# EAGLE schematic Schematic 1 v73 (EAGLE 9.7.0)
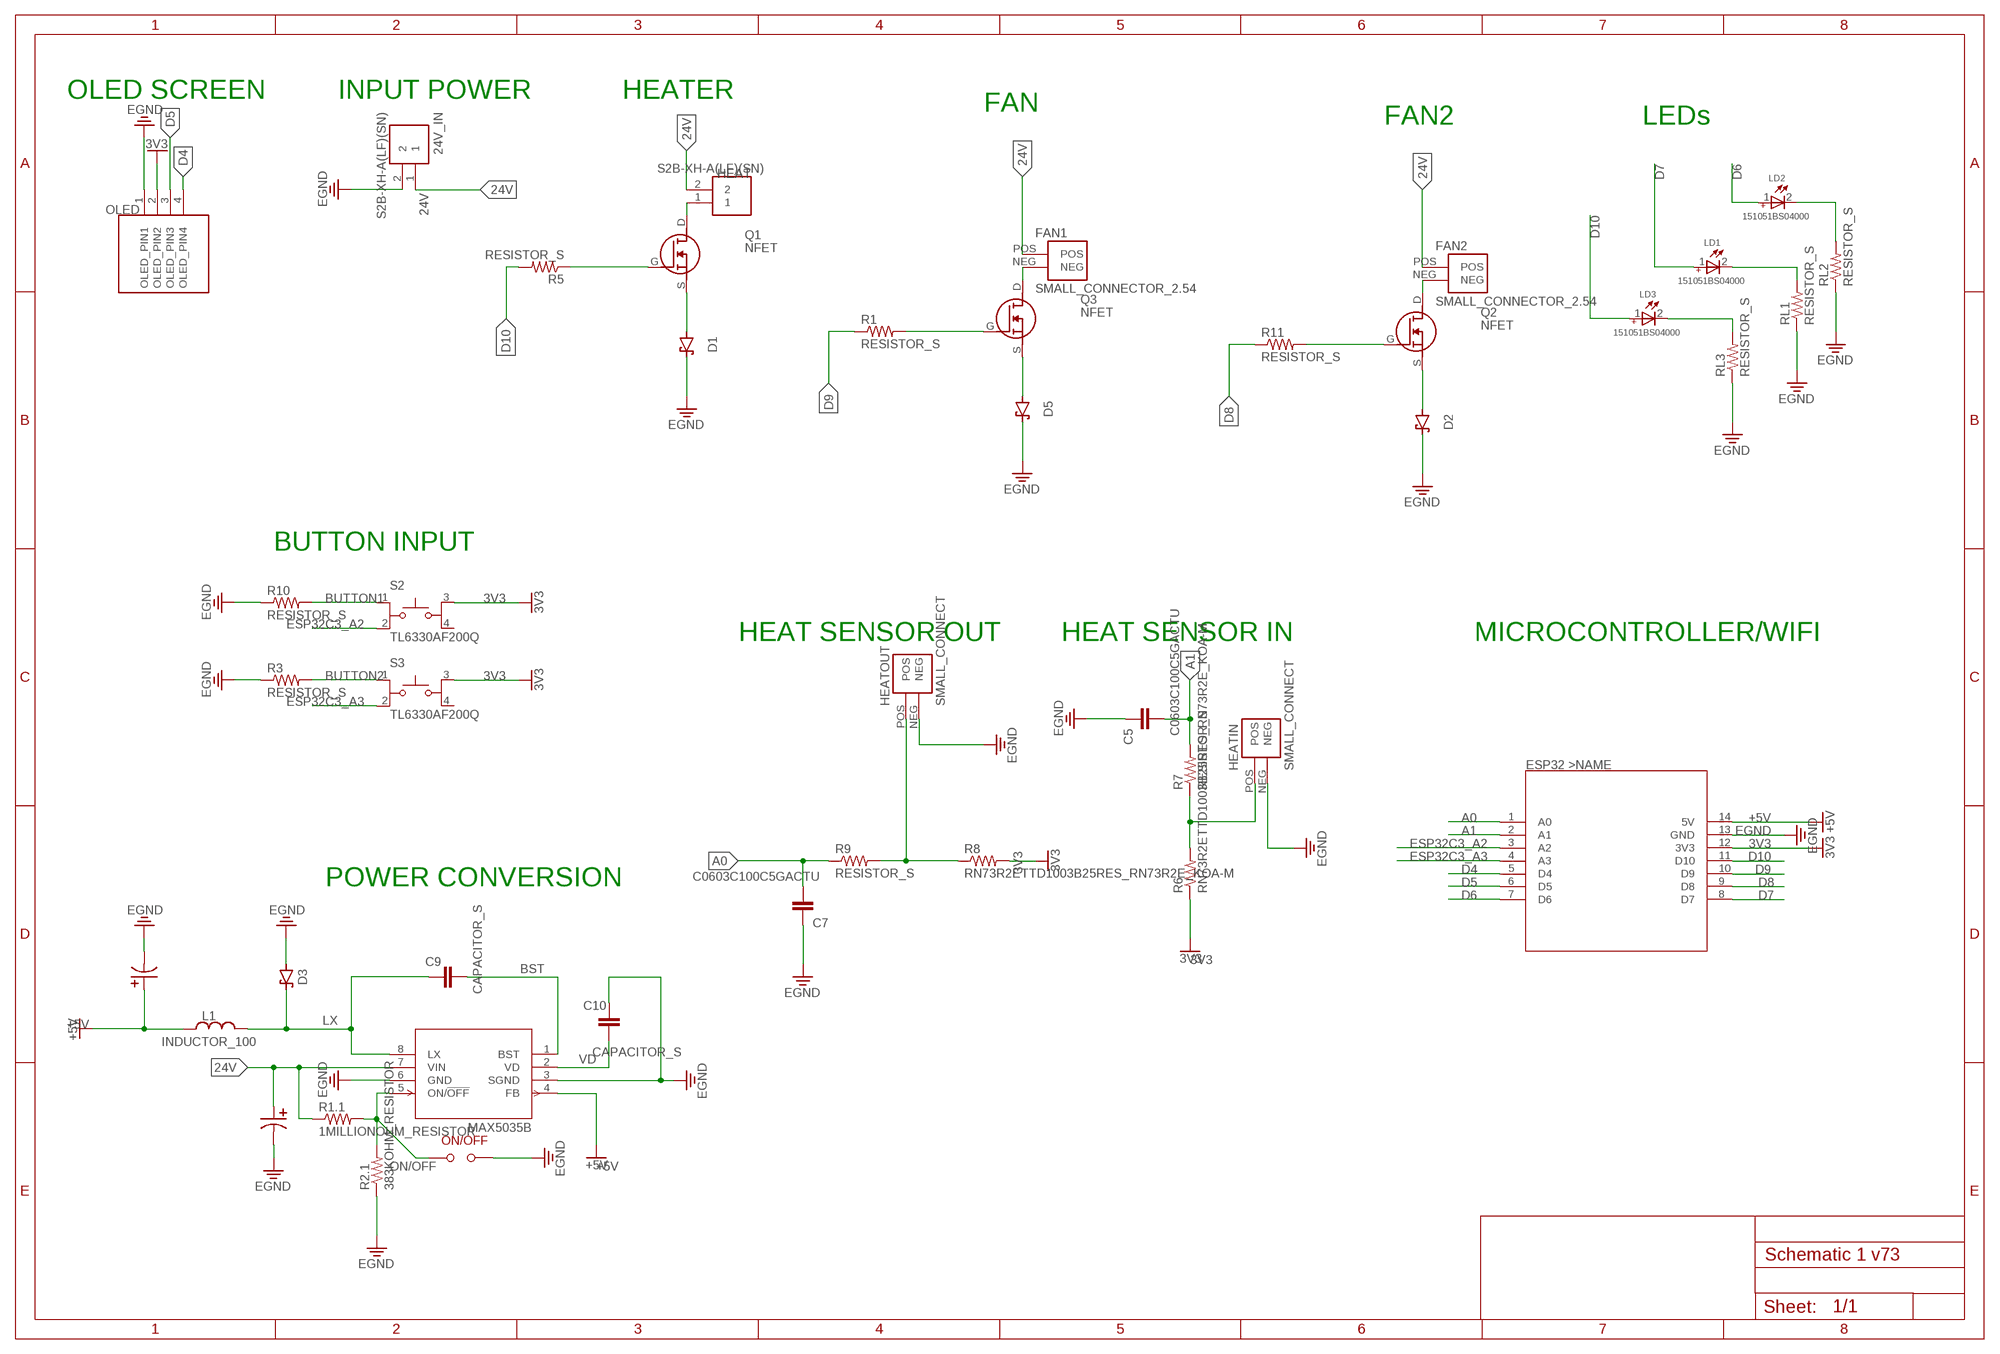
[diagram p0: schematic, sheet 1]

## Parts
24V_IN  S2B-XH-A(LF)(SN)  [HDR-02/RA]
C5  C0603C100C5GACTU  [CAP_0603]
C7  C0603C100C5GACTU  [CAP_0603]
C9  CAPACITOR_S  CAPACITOR_M  [CAPACITOR_M]
C10  CAPACITOR_S  CAPACITOR_M  [CAPACITOR_M]
D1  ES1D  SCHOTTKY_S  [SCHOTTKY_DIODE_S]
D2  ES1D  SCHOTTKY_S  [SCHOTTKY_DIODE_S]
D3  MBR0520LT1G  PANJIT_SB52AFC~SB56AFC_SERIES_DIODE_SCHOTTKY  [PANJIT_SB52AFC~SB56AFC_SERIES_DIODE]
D5  ES1D  SCHOTTKY_S  [SCHOTTKY_DIODE_S]
ESP32C3  XIAO_ESP32C3_ALT  [XIIO_ESP32C3_ALT]
FAN1  SMALL_CONNECTOR_2.54  [SMALL_CONNECT2.54]
FAN2  SMALL_CONNECTOR_2.54  [SMALL_CONNECT2.54]
HEAT  S2B-XH-A(LF)(SN)  [HDR-02/RA]
HEATIN  SMALL_CONNECT  [SMALL_CONNECT]
HEATOUT  SMALL_CONNECT  [SMALL_CONNECT]
L1  INDUCTOR_100  100UH_INDUCTOR  [100UH_INDUCTOR]
LD1  151051BS04000  WL-TMRC_5MM_151051BS04000_WITHOUTSTOPPER  [WL-TMRC_5MM]
LD2  151051BS04000  WL-TMRC_5MM_151051BS04000_WITHOUTSTOPPER  [WL-TMRC_5MM]
LD3  151051BS04000  WL-TMRC_5MM_151051BS04000_WITHOUTSTOPPER  [WL-TMRC_5MM]
OLED  I2C_OLED  [I2C_OLED]
ON/OFF  SOLDER_JUMPER  [SOLDER_JUMPER]
PC1  POLORIZED_100UF  TANTALUM_CAP  [TANTALUM_CAPACITOR_68UF]
PC2  68UF_POLORIZED_CAP  [68UF_CAPAE830X1000N]
Q1  NFET  [NFET]
Q2  NFET  [NFET]
Q3  NFET  [NFET]
R1  RESISTOR_S  [RESISTOR_S]
R1.1  1MILLIONOHM_RESISTOR  [1MOHM_RESISTOR_SMD]
R2.1  383KOHM_RESISTOR  [383KOHM_RESISTOR_0805]
R3  RESISTOR_S  [RESISTOR_S]
R5  RESISTOR_S  [RESISTOR_S]
R6  RN73R2ETTD1003B25RES_RN73R2E_KOA-M  [RES_RN73R2E_KOA-M]
R7  RESISTOR_S  [RESISTOR_S]
R8  RN73R2ETTD1003B25RES_RN73R2E_KOA-M  [RES_RN73R2E_KOA-M]
R9  RESISTOR_S  [RESISTOR_S]
R10  RESISTOR_S  [RESISTOR_S]
R11  RESISTOR_S  [RESISTOR_S]
RL1  RESISTOR_S  [RESISTOR_S]
RL2  RESISTOR_S  [RESISTOR_S]
RL3  RESISTOR_S  [RESISTOR_S]
S2  TL6330AF200Q  [SW_TL6330AF200Q]
S3  TL6330AF200Q  [SW_TL6330AF200Q]
U1  MAX5035BASA+T  [21-0041B_8_MXM-M]

## Nets
3V3: ESP32C3.12(3V3) OLED.2(OLED_PIN2) R6.2 R8.1 S2.3 S3.3
24V: 24V_IN.1 FAN1.POS FAN2.POS HEAT.2 PC2.POS R1.1.2 U1.7(VIN)
+5V: ESP32C3.14(5V) L1.P$1 PC1.+(POS) U1.4(FB)
A0: C7.2 ESP32C3.1(A0) R9.2
A1: C5.2 ESP32C3.2(A1) R7.1
BST: C9.2 U1.1(BST)
BUTTON1: R10.1 S2.1
BUTTON2: R3.1 S3.1
D4: ESP32C3.5(D4) OLED.4(OLED_PIN4)
D5: ESP32C3.6(D5) OLED.3(OLED_PIN3)
D6: ESP32C3.7(D6) LD2.1(+)
D7: ESP32C3.8(D7) LD1.1(+)
D8: ESP32C3.9(D8) R11.2
D9: ESP32C3.10(D9) R1.2
D10: ESP32C3.11(D10) LD3.1(+) R5.1
DRAIN1: HEAT.1 Q1.D
DRAIN2: FAN1.NEG Q3.D
DRAIN3: FAN2.NEG Q2.D
EGND [Ground]: 24V_IN.2 C5.1 C7.1 C10.1 D1.NEG D2.NEG D3.POS D5.NEG ESP32C3.13(GND) HEATIN.NEG HEATOUT.NEG OLED.1(OLED_PIN1) ON/OFF.P$2 PC1.-(NEG) PC2.NEG R2.1.2 R3.2 R10.2 RL1.2 RL2.2 RL3.2 U1.3(SGND) U1.6(GND)
ESP32C3_A2: ESP32C3.3(A2) S2.2
ESP32C3_A3: ESP32C3.4(A3) S3.2
GATE1: Q1.G R5.2
GATE2: Q3.G R1.1
GATE3: Q2.G R11.1
HEAT_IN: HEATIN.POS R6.1 R7.2
HEAT_OUT: HEATOUT.POS R8.2 R9.1
LX: C9.1 D3.NEG L1.P$2 U1.8(LX)
ON/OFF: ON/OFF.P$1 R1.1.1 R2.1.1 U1.5(ON/!OFF)
RL1: LD1.2(-) RL1.1
RL2: LD2.2(-) RL2.1
RL3: LD3.2(-) RL3.1
SOURCE1: D1.POS Q1.S
SOURCE2: D5.POS Q3.S
SOURCE3: D2.POS Q2.S
VD: C10.2 U1.2(VD)
Unconnected: S2.4 S3.4

## Notes on the sheet
- OLED SCREEN | INPUT POWER | HEATER
- FAN
- FAN2 | LEDs
- BUTTON INPUT
- HEAT SENSOR OUT | HEAT SENSOR IN | MICROCONTROLLER/WIFI
- POWER CONVERSION

## Library data of the parts
24V_IN HEAT = Connectors:S2B-XH-A(LF)(SN): CONN HEADER R/A 2POS 2.5MM Manufacturer's datasheet <http://www.jst-mfg.com/product/pdf/eng/eXH.pdf>; CREATED_BY: PCBLayout.com; DIGIKEY_PART_NUMBER: 455-2257-ND; MANUFACTURER: JST Sales America Inc.; MPN: S2B-XH-A(LF)(SN)
C5 C7 = Resistor_Capacitor:C0603C100C5GACTU: CAP CER 10PF 50V C0G/NP0 0603 Manufacturer's datasheet <https://content.kemet.com/datasheets/KEM_C1003_C0G_SMD.pdf>; CREATED_BY: PCBLayout.com; DIGIKEY_PART_NUMBER: 399-7814-2-ND; MANUFACTURER: KEMET; MPN: C0603C100C5GACTU; PACKAGE: SMD 0603
C9 C10 = At home - Capacitors/resistors/diodes/mosfets:CAPACITOR_M
D1 D2 D5 = At home - Capacitors/resistors/diodes/mosfets:SCHOTTKY_S
D3 = At home - Capacitors/resistors/diodes/mosfets:PANJIT_SB52AFC~SB56AFC_SERIES_DIODE_SCHOTTKY
ESP32C3 = Microcontrollers:XIAO_ESP32C3_ALT
FAN1 FAN2 = At home - Capacitors/resistors/diodes/mosfets:SMALL_CONNECTOR_2.54
HEATIN HEATOUT = At home - Capacitors/resistors/diodes/mosfets:SMALL_CONNECT
L1 = At home - Capacitors/resistors/diodes/mosfets:100UH_INDUCTOR
LD1-LD3 = Wurth_LEDs_WL-TMRC:WL-TMRC_5MM: WL-TMRC THT Mono-color Round Color Characteristics Low energy consumption High reliability Low current requirement Fast switching No UV/IR radiation Easy installation LED without stopper Variety of lens colors Variety of viewing angle Applications Status light Light guide design Commercial advertising Decorative lighting Interior and exterior lighting Outdoor LED panels Instrumentation and front panel indicator Traffic signal light Electronic and communication appliance Toys <https://www.we-online.com/catalog/media/o64621v209%20Family_WL_TMRC_THT.jpg> Details see: www.we-online.com/katalog/WL-TMRC <www.we-online.com/catalog/WL-TMRC/?utm_source=eagle_model&utm_medium=description_link&utm_campaign=eisos_eagle> Updated by Ella Wu, 2022-06-21 2022(C) Wurth Elektronik; CHIP-TECHNOLOGY: GaN; DATASHEET-URL: https://www.we-online.com/redexpert/spec/151051BS04000?ae; DOMINANT-WAVELENGTH: 470nm; EMITTING-COLOR: Blue; FORWARD-VOLTAGE: 3.2V; LUMINOUS-INTENSITY: 500mcd; MOUNT: THT; PART-NUMBER: 151051BS04000; PEAK-WAVELENGTH: 465nm; VIEWING-ANGLE: 40°
OLED = I2C_OLED:I2C_OLED
ON/OFF = At home - Capacitors/resistors/diodes/mosfets:SOLDER_JUMPER
PC1 = At home - Capacitors/resistors/diodes/mosfets:TANTALUM_CAP
PC2 = At home - Capacitors/resistors/diodes/mosfets:68UF_POLORIZED_CAP
Q1-Q3 = At home - Capacitors/resistors/diodes/mosfets:NFET
R1 R3 R5 R7 R9-R11 RL1-RL3 = At home - Capacitors/resistors/diodes/mosfets:RESISTOR_S
R1.1 = At home - Capacitors/resistors/diodes/mosfets:1MILLIONOHM_RESISTOR
R2.1 = At home - Capacitors/resistors/diodes/mosfets:383KOHM_RESISTOR
R6 R8 = 100K resistor 1%:RN73R2ETTD1003B25; COPYRIGHT: Copyright (C) 2022 Ultra Librarian. All rights reserved.; DIGI-KEY_PART_NUMBER_1: 2019-RN73R2ETTD1003B25TR-ND; DIGI-KEY_PART_NUMBER_2: 2019-RN73R2ETTD1003B25CT-ND; DIGI-KEY_PART_NUMBER_3: 2019-RN73R2ETTD1003B25DKR-ND; MANUFACTURER_PART_NUMBER: RN73R2ETTD1003B25; MFR_NAME: KOA Speer
S2 S3 = Tactile Switch:TL6330AF200Q; MANUFACTURER: E-Switch; MAXIMUM_PACKAGE_HEIGHT: 1.9 mm; PARTREV: D; SNAPEDA_PN: TL6330AF200Q; STANDARD: Manufacturer Recommendations
U1 = Buck Converters:MAX5035BASA+T